# Altium project fast-open-switch r1.0.PrjPcb (part 8 of 8)
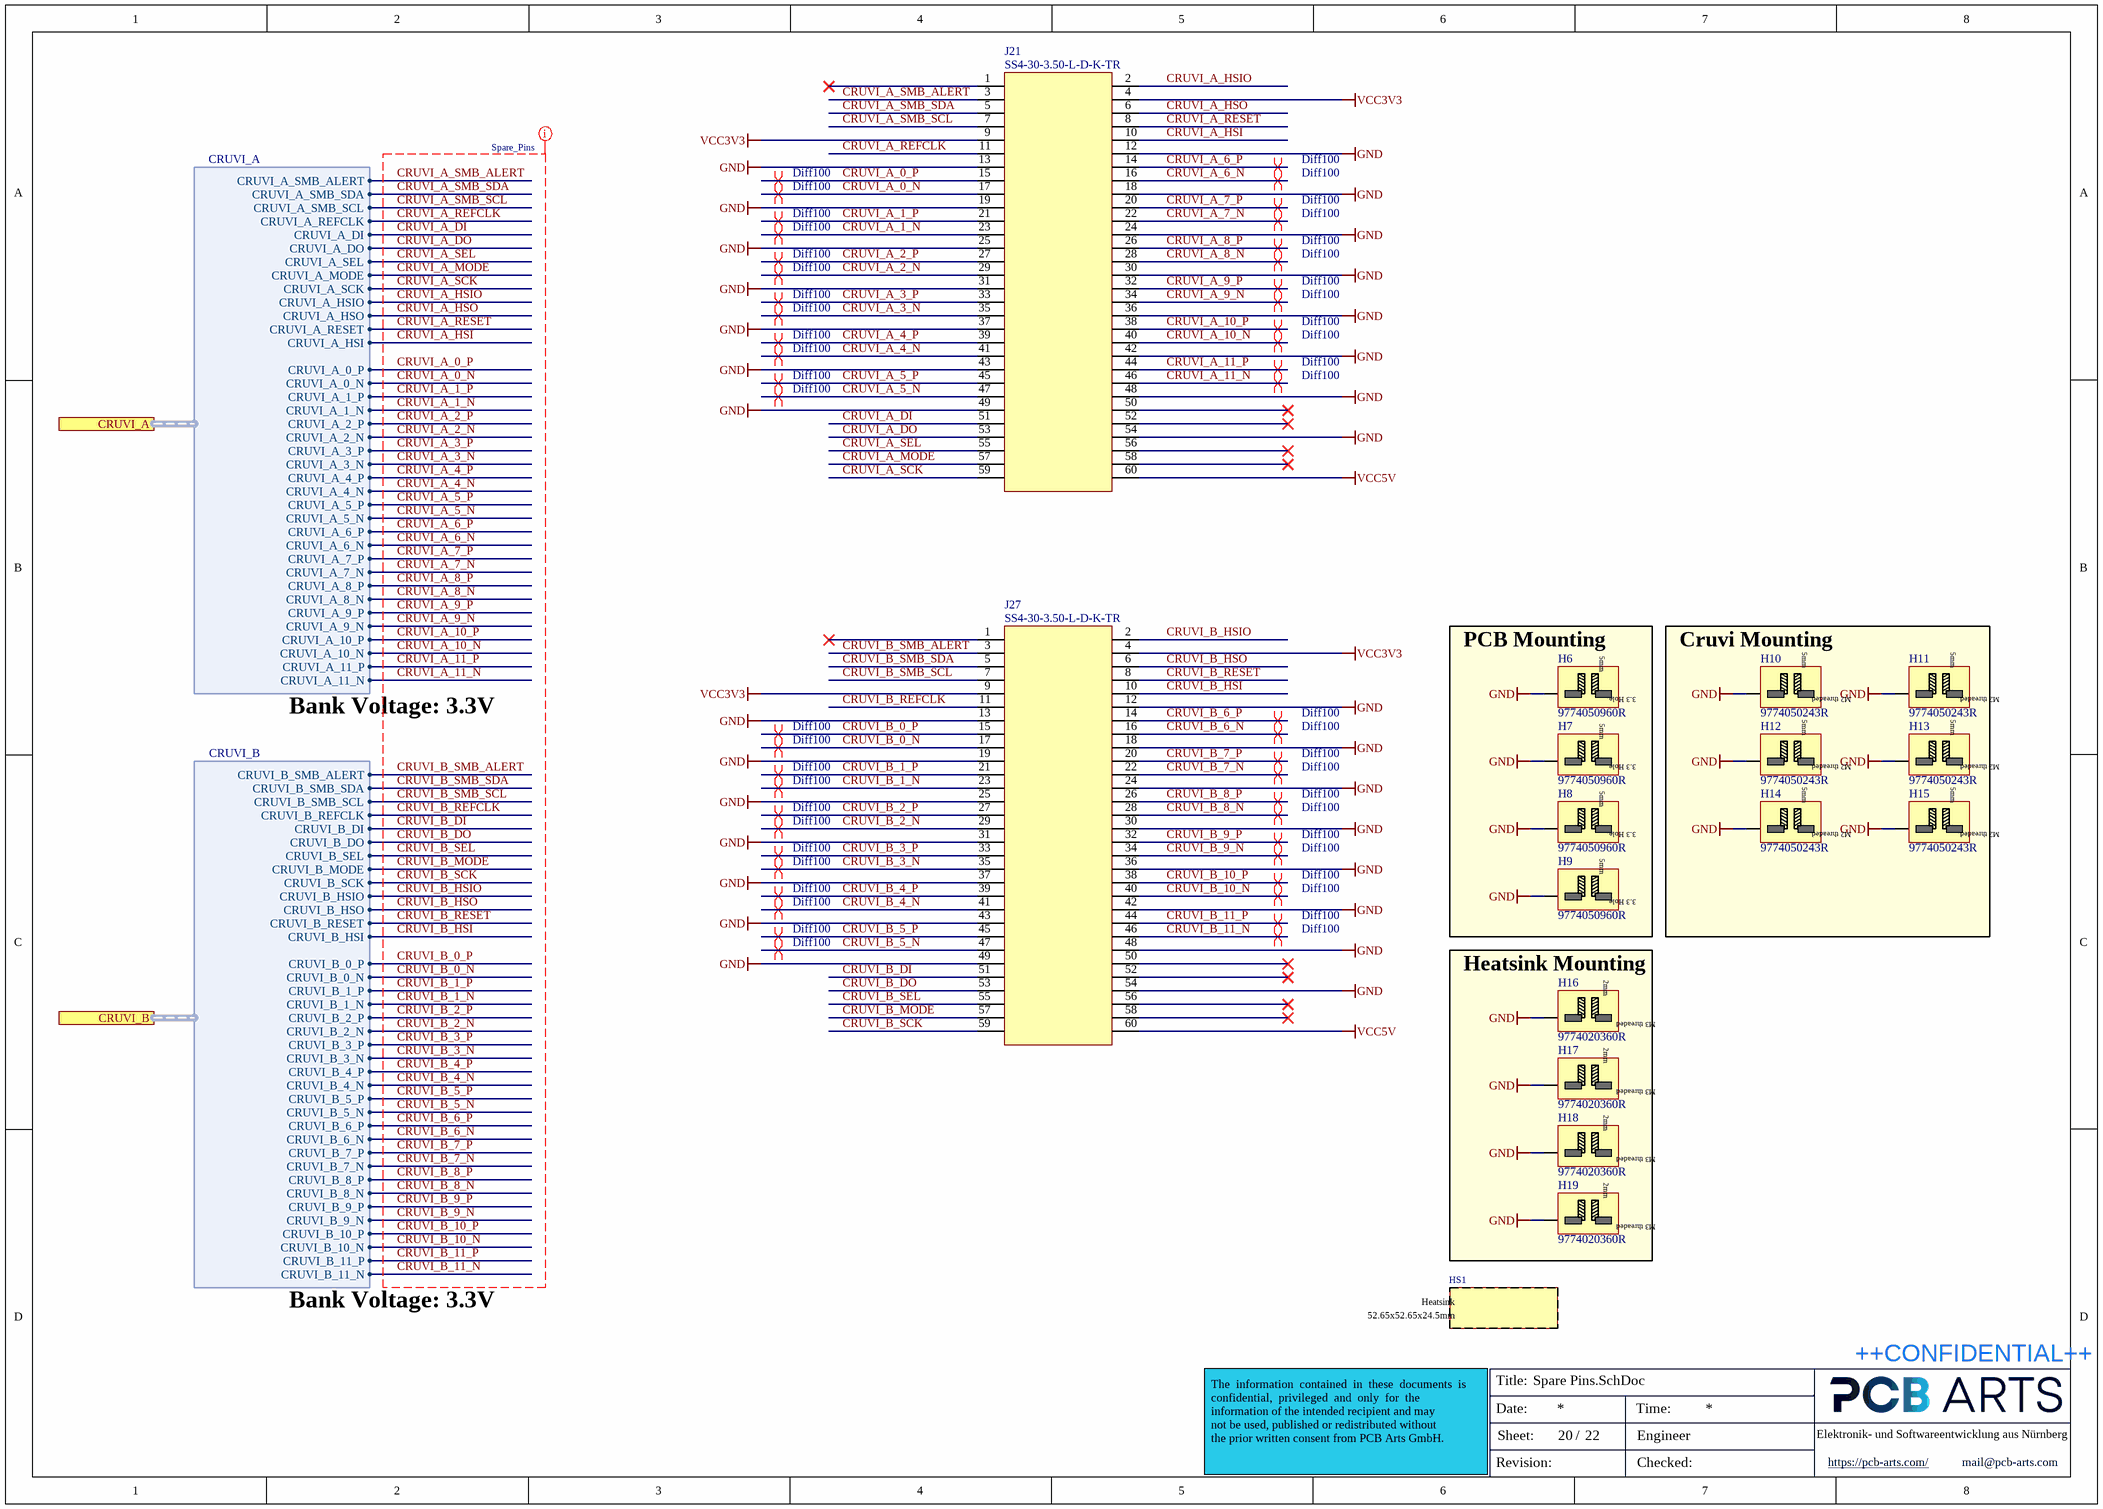
[diagram p22: Spare Pins.SchDoc]

## Nets that join several sheets
CM4_3V3: Raspberry Pi CM4 (9 pins), Raspberry Pi CM4_Periphery (C116.1 J9.10 J9.12 J12.4)
GND: Bank 0_Bank 14 (31 pins), Bank 13_Bank 15_Bank 16 (J16.0 J16.1 J29.1 J30.1), DDR3 Memory_Banks 32-33-34 (21 pins), DDR3 Memory_SO-DIMM (85 pins), FPGA_HDMI_IN_OUT (81 pins), HMI (34 pins), QSPI Flash_eMMC_uSD-Card (38 pins), Raspberry Pi CM4 (60 pins), SFP+_Connectors (68 pins), SSD M.2_B-Key (14 pins), USB-HUB-MUX (75 pins), USB-UART-interface (18 pins), Raspberry Pi CM4_Periphery (45 pins), I2C Multiplexer (5 pins), System Clocks (27 pins), FPGA Supply Pins (187 pins), PWR_CTRL (28 pins), Buck Modules (172 pins), Spare Pins (44 pins)
MGTAVCC: FPGA Supply Pins (11 pins), PWR_CTRL (R226.2), Buck Modules (9 pins)
MGTAVTT: MGT Banks 115-116 (R16.2 U1.M5), FPGA Supply Pins (16 pins), PWR_CTRL (R222.2), Buck Modules (9 pins)
VCC1V0_FPGA: FPGA Supply Pins (36 pins), PWR_CTRL (R215.2), Buck Modules (16 pins)
VCC1V5: DDR3 Memory_Banks 32-33-34 (8 pins), DDR3 Memory_SO-DIMM (43 pins), FPGA Supply Pins (27 pins), Buck Modules (9 pins)
VCC1V8: Bank 0_Bank 14 (5 pins), HMI (15 pins), QSPI Flash_eMMC_uSD-Card (29 pins), SMI Bank 12 (Q5.1 Q6.1 R88.2 R90.2), I2C Multiplexer (8 pins), System Clocks (18 pins), FPGA Supply Pins (19 pins), Buck Modules (9 pins)
VCC1V8_AUX: FPGA Supply Pins (17 pins), PWR_CTRL (R220.2), Buck Modules (9 pins)
VCC2V5: Bank 0_Bank 14 (9 pins), DDR3 Memory_Banks 32-33-34 (U2.7), QSPI Flash_eMMC_uSD-Card (C161.2 U16.8), FPGA Supply Pins (5 pins), Buck Modules (9 pins)
VCC3V3: Bank 0_Bank 14 (C148.1 D29.2 R96.1 U12.5), Bank 13_Bank 15_Bank 16 (10 pins), DDR3 Memory_Banks 32-33-34 (C4.1 C5.2 U2.10), DDR3 Memory_SO-DIMM (C15.2 J1.199 R12.2 R13.2), FPGA_HDMI_IN_OUT (25 pins), HMI (J25.2 J28.4 R173.2 R174.2), QSPI Flash_eMMC_uSD-Card (16 pins), Raspberry Pi CM4 (R69.2), SFP+_Connectors (40 pins), SMI Bank 12 (R87.2 R89.2), SSD M.2_B-Key (9 pins), USB-HUB-MUX (12 pins), System Clocks (C195.2 R208.2 R209.2 U24.8), FPGA Supply Pins (28 pins), Buck Modules (14 pins), Spare Pins (J21.4 J21.9 J27.4 J27.9)
VCC5V: Bank 13_Bank 15_Bank 16 (J16.2 R92.2), FPGA_HDMI_IN_OUT (5 pins), Raspberry Pi CM4 (6 pins), USB-HUB-MUX (C140.1 U8.5), Raspberry Pi CM4_Periphery (5 pins), PWR_CTRL (R213.2), Buck Modules (9 pins), Spare Pins (J21.60 J27.60)
VCC5V_SB: PWR_CTRL (12 pins), Buck Modules (C399.1 C400.1 U40.5 U41.5)
VCC12V: Bank 13_Bank 15_Bank 16 (J29.2 J30.2), PWR_CTRL (8 pins), Buck Modules (70 pins)
VCC_USB: Bank 0_Bank 14 (R98.2), USB-HUB-MUX (6 pins)
VTTDDR: DDR3 Memory_Banks 32-33-34 (6 pins), DDR3 Memory_SO-DIMM (10 pins)
VTTVREF: DDR3 Memory_Banks 32-33-34 (11 pins), DDR3 Memory_SO-DIMM (C16.1 J1.1 J1.126)
150MHz_REFCLK_N: MGT Banks 115-116 (R18.2 U1.F5), System Clocks (Y5.5)
150MHz_REFCLK_P: MGT Banks 115-116 (R18.1 U1.F6), System Clocks (Y5.4)
156.25MHz_REFCLK_N: MGT Banks 115-116 (R19.2 U1.H5), System Clocks (Y6.5)
156.25MHz_REFCLK_P: MGT Banks 115-116 (R19.1 U1.H6), System Clocks (Y6.4)
200MHz_SYSCLK_N: DDR3 Memory_Banks 32-33-34 (R9.1 U1.AD9), System Clocks (Y4.5)
200MHz_SYSCLK_P: DDR3 Memory_Banks 32-33-34 (R9.2 U1.AC9), System Clocks (Y4.4)
Button_C: Bank 0_Bank 14 (U1.H23), HMI (C418.1 J28.5 R180.1 R258.1)
Button_D: Bank 0_Bank 14 (U1.G22), HMI (C420.1 J28.3 R260.1 R261.1)
Button_L: Bank 0_Bank 14 (U1.H22), HMI (C417.1 J28.1 R179.1 R257.1)
Button_R: Bank 0_Bank 14 (U1.H24), HMI (C419.1 J28.7 R185.1 R259.1)
Button_U: Bank 0_Bank 14 (U1.J24), HMI (C416.1 J28.9 R175.1 R178.1)
CM4_GBE_LED_G: Raspberry Pi CM4 (J7.17), Raspberry Pi CM4_Periphery (R77.1)
CM4_GBE_LED_Y: Raspberry Pi CM4 (J7.15), Raspberry Pi CM4_Periphery (R76.1)
CM4_GBE_MDI0_N: Raspberry Pi CM4 (J7.10), Raspberry Pi CM4_Periphery (T1.14)
CM4_GBE_MDI0_P: Raspberry Pi CM4 (J7.12), Raspberry Pi CM4_Periphery (T1.13)
CM4_GBE_MDI1_N: Raspberry Pi CM4 (J7.6), Raspberry Pi CM4_Periphery (T1.17)
CM4_GBE_MDI1_P: Raspberry Pi CM4 (J7.4), Raspberry Pi CM4_Periphery (T1.16)
CM4_GBE_MDI2_N: Raspberry Pi CM4 (J7.9), Raspberry Pi CM4_Periphery (T1.20)
CM4_GBE_MDI2_P: Raspberry Pi CM4 (J7.11), Raspberry Pi CM4_Periphery (T1.19)
CM4_GBE_MDI3_N: Raspberry Pi CM4 (J7.5), Raspberry Pi CM4_Periphery (T1.22)
CM4_GBE_MDI3_P: Raspberry Pi CM4 (J7.3), Raspberry Pi CM4_Periphery (T1.23)
CM4_OTG_ID: Raspberry Pi CM4 (J8.101), USB-HUB-MUX (R68.2 R132.2 U10.2)
CM4_USB_N: Raspberry Pi CM4 (J8.103), USB-HUB-MUX (U10.4)
CM4_USB_P: Raspberry Pi CM4 (J8.105), USB-HUB-MUX (U10.3)
CM4_µSD_CLK: Raspberry Pi CM4 (J7.57), Raspberry Pi CM4_Periphery (D20.2 J12.5)
CM4_µSD_CMD: Raspberry Pi CM4 (J7.62), Raspberry Pi CM4_Periphery (D21.2 J12.3)
CM4_µSD_DAT0: Raspberry Pi CM4 (J7.63), Raspberry Pi CM4_Periphery (D16.2 J12.7)
CM4_µSD_DAT1: Raspberry Pi CM4 (J7.67), Raspberry Pi CM4_Periphery (D17.2 J12.8)
CM4_µSD_DAT2: Raspberry Pi CM4 (J7.69), Raspberry Pi CM4_Periphery (D18.2 J12.1)
CM4_µSD_DAT3: Raspberry Pi CM4 (J7.61), Raspberry Pi CM4_Periphery (D19.2 J12.2)
CRUVI_A_0_N: Bank 13_Bank 15_Bank 16 (U1.F13), Spare Pins (J21.17)
CRUVI_A_0_P: Bank 13_Bank 15_Bank 16 (U1.F14), Spare Pins (J21.15)
CRUVI_A_1_N: Bank 13_Bank 15_Bank 16 (U1.A12), Spare Pins (J21.23)
CRUVI_A_1_P: Bank 13_Bank 15_Bank 16 (U1.A13), Spare Pins (J21.21)
CRUVI_A_2_N: Bank 13_Bank 15_Bank 16 (U1.D8), Spare Pins (J21.29)
CRUVI_A_2_P: Bank 13_Bank 15_Bank 16 (U1.D9), Spare Pins (J21.27)
CRUVI_A_3_N: Bank 13_Bank 15_Bank 16 (U1.B9), Spare Pins (J21.35)
CRUVI_A_3_P: Bank 13_Bank 15_Bank 16 (U1.C9), Spare Pins (J21.33)
CRUVI_A_4_N: Bank 13_Bank 15_Bank 16 (U1.A10), Spare Pins (J21.41)
CRUVI_A_4_P: Bank 13_Bank 15_Bank 16 (U1.B10), Spare Pins (J21.39)
CRUVI_A_5_N: Bank 13_Bank 15_Bank 16 (U1.B11), Spare Pins (J21.47)
CRUVI_A_5_P: Bank 13_Bank 15_Bank 16 (U1.B12), Spare Pins (J21.45)
CRUVI_A_6_N: Bank 13_Bank 15_Bank 16 (U1.C11), Spare Pins (J21.16)
CRUVI_A_6_P: Bank 13_Bank 15_Bank 16 (U1.C12), Spare Pins (J21.14)
CRUVI_A_7_N: Bank 13_Bank 15_Bank 16 (U1.A14), Spare Pins (J21.22)
CRUVI_A_7_P: Bank 13_Bank 15_Bank 16 (U1.B14), Spare Pins (J21.20)
CRUVI_A_8_N: Bank 13_Bank 15_Bank 16 (U1.A15), Spare Pins (J21.28)
CRUVI_A_8_P: Bank 13_Bank 15_Bank 16 (U1.B15), Spare Pins (J21.26)
CRUVI_A_9_N: Bank 13_Bank 15_Bank 16 (U1.C13), Spare Pins (J21.34)
CRUVI_A_9_P: Bank 13_Bank 15_Bank 16 (U1.C14), Spare Pins (J21.32)
CRUVI_A_10_N: Bank 13_Bank 15_Bank 16 (U1.G14), Spare Pins (J21.40)
CRUVI_A_10_P: Bank 13_Bank 15_Bank 16 (U1.H14), Spare Pins (J21.38)
CRUVI_A_11_N: Bank 13_Bank 15_Bank 16 (U1.D13), Spare Pins (J21.46)
CRUVI_A_11_P: Bank 13_Bank 15_Bank 16 (U1.D14), Spare Pins (J21.44)
CRUVI_A_DI: Bank 13_Bank 15_Bank 16 (U1.G19), Spare Pins (J21.51)
CRUVI_A_DO: Bank 13_Bank 15_Bank 16 (U1.D20), Spare Pins (J21.53)
CRUVI_A_HSI: Bank 13_Bank 15_Bank 16 (U1.F17), Spare Pins (J21.10)
CRUVI_A_HSIO: Bank 13_Bank 15_Bank 16 (U1.H18), Spare Pins (J21.2)
CRUVI_A_HSO: Bank 13_Bank 15_Bank 16 (U1.H17), Spare Pins (J21.6)
CRUVI_A_MODE: Bank 13_Bank 15_Bank 16 (U1.F20), Spare Pins (J21.57)
CRUVI_A_REFCLK: Bank 13_Bank 15_Bank 16 (U1.E17), Spare Pins (J21.11)
CRUVI_A_RESET: Bank 13_Bank 15_Bank 16 (U1.H16), Spare Pins (J21.8)
CRUVI_A_SCK: Bank 13_Bank 15_Bank 16 (U1.G20), Spare Pins (J21.59)
CRUVI_A_SEL: Bank 13_Bank 15_Bank 16 (U1.E20), Spare Pins (J21.55)
CRUVI_A_SMB_ALERT: Bank 13_Bank 15_Bank 16 (U1.H19), Spare Pins (J21.3)
CRUVI_A_SMB_SCL: Bank 13_Bank 15_Bank 16 (R285.1 U1.G17), Spare Pins (J21.7)
CRUVI_A_SMB_SDA: Bank 13_Bank 15_Bank 16 (R283.1 U1.F19), Spare Pins (J21.5)
CRUVI_B_0_N: Bank 13_Bank 15_Bank 16 (U1.J10), Spare Pins (J27.17)
CRUVI_B_0_P: Bank 13_Bank 15_Bank 16 (U1.J11), Spare Pins (J27.15)
CRUVI_B_1_N: Bank 13_Bank 15_Bank 16 (U1.H8), Spare Pins (J27.23)
CRUVI_B_1_P: Bank 13_Bank 15_Bank 16 (U1.H9), Spare Pins (J27.21)
CRUVI_B_2_N: Bank 13_Bank 15_Bank 16 (U1.G9), Spare Pins (J27.29)
CRUVI_B_2_P: Bank 13_Bank 15_Bank 16 (U1.G10), Spare Pins (J27.27)
CRUVI_B_3_N: Bank 13_Bank 15_Bank 16 (U1.F8), Spare Pins (J27.35)
CRUVI_B_3_P: Bank 13_Bank 15_Bank 16 (U1.F9), Spare Pins (J27.33)
CRUVI_B_4_N: Bank 13_Bank 15_Bank 16 (U1.F10), Spare Pins (J27.41)
CRUVI_B_4_P: Bank 13_Bank 15_Bank 16 (U1.G11), Spare Pins (J27.39)
CRUVI_B_5_N: Bank 13_Bank 15_Bank 16 (U1.D10), Spare Pins (J27.47)
CRUVI_B_5_P: Bank 13_Bank 15_Bank 16 (U1.E10), Spare Pins (J27.45)
CRUVI_B_6_N: Bank 13_Bank 15_Bank 16 (U1.A8), Spare Pins (J27.16)
CRUVI_B_6_P: Bank 13_Bank 15_Bank 16 (U1.A9), Spare Pins (J27.14)
CRUVI_B_7_N: Bank 13_Bank 15_Bank 16 (U1.D11), Spare Pins (J27.22)
CRUVI_B_7_P: Bank 13_Bank 15_Bank 16 (U1.E11), Spare Pins (J27.20)
CRUVI_B_8_N: Bank 13_Bank 15_Bank 16 (U1.F12), Spare Pins (J27.28)
CRUVI_B_8_P: Bank 13_Bank 15_Bank 16 (U1.G12), Spare Pins (J27.26)
CRUVI_B_9_N: Bank 13_Bank 15_Bank 16 (U1.E12), Spare Pins (J27.34)
CRUVI_B_9_P: Bank 13_Bank 15_Bank 16 (U1.E13), Spare Pins (J27.32)
CRUVI_B_10_N: Bank 13_Bank 15_Bank 16 (U1.H11), Spare Pins (J27.40)
CRUVI_B_10_P: Bank 13_Bank 15_Bank 16 (U1.H12), Spare Pins (J27.38)
CRUVI_B_11_N: Bank 13_Bank 15_Bank 16 (U1.H13), Spare Pins (J27.46)
CRUVI_B_11_P: Bank 13_Bank 15_Bank 16 (U1.J13), Spare Pins (J27.44)
CRUVI_B_DI: Bank 13_Bank 15_Bank 16 (U1.J15), Spare Pins (J27.51)
CRUVI_B_DO: Bank 13_Bank 15_Bank 16 (U1.C18), Spare Pins (J27.53)
CRUVI_B_HSI: Bank 13_Bank 15_Bank 16 (U1.G16), Spare Pins (J27.10)
CRUVI_B_HSIO: Bank 13_Bank 15_Bank 16 (U1.F15), Spare Pins (J27.2)
CRUVI_B_HSO: Bank 13_Bank 15_Bank 16 (U1.D16), Spare Pins (J27.6)
CRUVI_B_MODE: Bank 13_Bank 15_Bank 16 (U1.E18), Spare Pins (J27.57)
CRUVI_B_REFCLK: Bank 13_Bank 15_Bank 16 (U1.E16), Spare Pins (J27.11)
CRUVI_B_RESET: Bank 13_Bank 15_Bank 16 (U1.D15), Spare Pins (J27.8)
CRUVI_B_SCK: Bank 13_Bank 15_Bank 16 (U1.D19), Spare Pins (J27.59)
CRUVI_B_SEL: Bank 13_Bank 15_Bank 16 (U1.D18), Spare Pins (J27.55)
CRUVI_B_SMB_ALERT: Bank 13_Bank 15_Bank 16 (U1.G15), Spare Pins (J27.3)
CRUVI_B_SMB_SCL: Bank 13_Bank 15_Bank 16 (R286.1 U1.E15), Spare Pins (J27.7)
CRUVI_B_SMB_SDA: Bank 13_Bank 15_Bank 16 (R284.1 U1.J16), Spare Pins (J27.5)
CS_MAN_CTRL: Bank 0_Bank 14 (U1.C22), QSPI Flash_eMMC_uSD-Card (J20.16 R117.1)
DDR3_A0: DDR3 Memory_Banks 32-33-34 (U1.AF7), DDR3 Memory_SO-DIMM (J1.98)
DDR3_A1: DDR3 Memory_Banks 32-33-34 (U1.AD8), DDR3 Memory_SO-DIMM (J1.97)
DDR3_A2: DDR3 Memory_Banks 32-33-34 (U1.AB10), DDR3 Memory_SO-DIMM (J1.96)
DDR3_A3: DDR3 Memory_Banks 32-33-34 (U1.AC8), DDR3 Memory_SO-DIMM (J1.95)
DDR3_A4: DDR3 Memory_Banks 32-33-34 (U1.W11), DDR3 Memory_SO-DIMM (J1.92)
DDR3_A5: DDR3 Memory_Banks 32-33-34 (U1.AA12), DDR3 Memory_SO-DIMM (J1.91)
DDR3_A6: DDR3 Memory_Banks 32-33-34 (U1.AC12), DDR3 Memory_SO-DIMM (J1.90)
DDR3_A7: DDR3 Memory_Banks 32-33-34 (U1.AD13), DDR3 Memory_SO-DIMM (J1.86)
DDR3_A8: DDR3 Memory_Banks 32-33-34 (U1.AB12), DDR3 Memory_SO-DIMM (J1.89)
DDR3_A9: DDR3 Memory_Banks 32-33-34 (U1.AD11), DDR3 Memory_SO-DIMM (J1.85)
DDR3_A10: DDR3 Memory_Banks 32-33-34 (U1.AE7), DDR3 Memory_SO-DIMM (J1.107)
DDR3_A11: DDR3 Memory_Banks 32-33-34 (U1.Y11), DDR3 Memory_SO-DIMM (J1.84)
DDR3_A12: DDR3 Memory_Banks 32-33-34 (U1.AA13), DDR3 Memory_SO-DIMM (J1.83)
DDR3_A13: DDR3 Memory_Banks 32-33-34 (U1.AB7), DDR3 Memory_SO-DIMM (J1.119)
DDR3_A14: DDR3 Memory_Banks 32-33-34 (U1.Y13), DDR3 Memory_SO-DIMM (J1.80)
DDR3_A15: DDR3 Memory_Banks 32-33-34 (U1.Y12), DDR3 Memory_SO-DIMM (J1.78)
DDR3_BA0: DDR3 Memory_Banks 32-33-34 (U1.AC7), DDR3 Memory_SO-DIMM (J1.109)
DDR3_BA1: DDR3 Memory_Banks 32-33-34 (U1.V8), DDR3 Memory_SO-DIMM (J1.108)
DDR3_BA2: DDR3 Memory_Banks 32-33-34 (U1.AC13), DDR3 Memory_SO-DIMM (J1.79)
DDR3_~{CAS}: DDR3 Memory_Banks 32-33-34 (U1.AA7), DDR3 Memory_SO-DIMM (J1.115)
DDR3_CKE0: DDR3 Memory_Banks 32-33-34 (U1.Y10), DDR3 Memory_SO-DIMM (J1.73 R10.2)
DDR3_CKE1: DDR3 Memory_Banks 32-33-34 (U1.W9), DDR3 Memory_SO-DIMM (J1.74 R11.2)
DDR3_CLK0_N: DDR3 Memory_Banks 32-33-34 (U1.AC11), DDR3 Memory_SO-DIMM (J1.103)
DDR3_CLK0_P: DDR3 Memory_Banks 32-33-34 (U1.AB11), DDR3 Memory_SO-DIMM (J1.101)
DDR3_CLK1_N: DDR3 Memory_Banks 32-33-34 (U1.AB9), DDR3 Memory_SO-DIMM (J1.104)
DDR3_CLK1_P: DDR3 Memory_Banks 32-33-34 (U1.AA9), DDR3 Memory_SO-DIMM (J1.102)
DDR3_D0: DDR3 Memory_Banks 32-33-34 (U1.AB17), DDR3 Memory_SO-DIMM (J1.5)
DDR3_D1: DDR3 Memory_Banks 32-33-34 (U1.AC18), DDR3 Memory_SO-DIMM (J1.7)
DDR3_D2: DDR3 Memory_Banks 32-33-34 (U1.AC17), DDR3 Memory_SO-DIMM (J1.15)
DDR3_D3: DDR3 Memory_Banks 32-33-34 (U1.AD19), DDR3 Memory_SO-DIMM (J1.17)
DDR3_D4: DDR3 Memory_Banks 32-33-34 (U1.AA19), DDR3 Memory_SO-DIMM (J1.4)
DDR3_D5: DDR3 Memory_Banks 32-33-34 (U1.AA20), DDR3 Memory_SO-DIMM (J1.6)
DDR3_D6: DDR3 Memory_Banks 32-33-34 (U1.AD18), DDR3 Memory_SO-DIMM (J1.16)
DDR3_D7: DDR3 Memory_Banks 32-33-34 (U1.AC16), DDR3 Memory_SO-DIMM (J1.18)
DDR3_D8: DDR3 Memory_Banks 32-33-34 (U1.V16), DDR3 Memory_SO-DIMM (J1.21)
DDR3_D9: DDR3 Memory_Banks 32-33-34 (U1.V18), DDR3 Memory_SO-DIMM (J1.23)
DDR3_D10: DDR3 Memory_Banks 32-33-34 (U1.AB20), DDR3 Memory_SO-DIMM (J1.33)
DDR3_D11: DDR3 Memory_Banks 32-33-34 (U1.AB19), DDR3 Memory_SO-DIMM (J1.35)
DDR3_D12: DDR3 Memory_Banks 32-33-34 (U1.W15), DDR3 Memory_SO-DIMM (J1.22)
DDR3_D13: DDR3 Memory_Banks 32-33-34 (U1.V19), DDR3 Memory_SO-DIMM (J1.24)
DDR3_D14: DDR3 Memory_Banks 32-33-34 (U1.W16), DDR3 Memory_SO-DIMM (J1.34)
DDR3_D15: DDR3 Memory_Banks 32-33-34 (U1.Y17), DDR3 Memory_SO-DIMM (J1.36)
DDR3_D16: DDR3 Memory_Banks 32-33-34 (U1.AF19), DDR3 Memory_SO-DIMM (J1.39)
DDR3_D17: DDR3 Memory_Banks 32-33-34 (U1.AE17), DDR3 Memory_SO-DIMM (J1.41)
DDR3_D18: DDR3 Memory_Banks 32-33-34 (U1.AE15), DDR3 Memory_SO-DIMM (J1.51)
DDR3_D19: DDR3 Memory_Banks 32-33-34 (U1.AF15), DDR3 Memory_SO-DIMM (J1.53)
DDR3_D20: DDR3 Memory_Banks 32-33-34 (U1.AF20), DDR3 Memory_SO-DIMM (J1.40)
DDR3_D21: DDR3 Memory_Banks 32-33-34 (U1.AD16), DDR3 Memory_SO-DIMM (J1.42)
DDR3_D22: DDR3 Memory_Banks 32-33-34 (U1.AD15), DDR3 Memory_SO-DIMM (J1.50)
DDR3_D23: DDR3 Memory_Banks 32-33-34 (U1.AF14), DDR3 Memory_SO-DIMM (J1.52)
DDR3_D24: DDR3 Memory_Banks 32-33-34 (U1.AA15), DDR3 Memory_SO-DIMM (J1.57)
DDR3_D25: DDR3 Memory_Banks 32-33-34 (U1.AB16), DDR3 Memory_SO-DIMM (J1.59)
DDR3_D26: DDR3 Memory_Banks 32-33-34 (U1.AD14), DDR3 Memory_SO-DIMM (J1.67)
DDR3_D27: DDR3 Memory_Banks 32-33-34 (U1.AB14), DDR3 Memory_SO-DIMM (J1.69)
DDR3_D28: DDR3 Memory_Banks 32-33-34 (U1.AA18), DDR3 Memory_SO-DIMM (J1.56)
DDR3_D29: DDR3 Memory_Banks 32-33-34 (U1.AA17), DDR3 Memory_SO-DIMM (J1.58)
DDR3_D30: DDR3 Memory_Banks 32-33-34 (U1.AB15), DDR3 Memory_SO-DIMM (J1.68)
DDR3_D31: DDR3 Memory_Banks 32-33-34 (U1.AC14), DDR3 Memory_SO-DIMM (J1.70)
DDR3_D32: DDR3 Memory_Banks 32-33-34 (U1.AD6), DDR3 Memory_SO-DIMM (J1.129)
DDR3_D33: DDR3 Memory_Banks 32-33-34 (U1.AC6), DDR3 Memory_SO-DIMM (J1.131)
DDR3_D34: DDR3 Memory_Banks 32-33-34 (U1.AC3), DDR3 Memory_SO-DIMM (J1.141)
DDR3_D35: DDR3 Memory_Banks 32-33-34 (U1.AB4), DDR3 Memory_SO-DIMM (J1.143)
DDR3_D36: DDR3 Memory_Banks 32-33-34 (U1.AB6), DDR3 Memory_SO-DIMM (J1.130)
DDR3_D37: DDR3 Memory_Banks 32-33-34 (U1.Y6), DDR3 Memory_SO-DIMM (J1.132)
DDR3_D38: DDR3 Memory_Banks 32-33-34 (U1.Y5), DDR3 Memory_SO-DIMM (J1.140)
DDR3_D39: DDR3 Memory_Banks 32-33-34 (U1.AA4), DDR3 Memory_SO-DIMM (J1.142)
DDR3_D40: DDR3 Memory_Banks 32-33-34 (U1.AF3), DDR3 Memory_SO-DIMM (J1.147)
DDR3_D41: DDR3 Memory_Banks 32-33-34 (U1.AE3), DDR3 Memory_SO-DIMM (J1.149)
DDR3_D42: DDR3 Memory_Banks 32-33-34 (U1.AE2), DDR3 Memory_SO-DIMM (J1.157)
DDR3_D43: DDR3 Memory_Banks 32-33-34 (U1.AE1), DDR3 Memory_SO-DIMM (J1.159)
DDR3_D44: DDR3 Memory_Banks 32-33-34 (U1.AE6), DDR3 Memory_SO-DIMM (J1.146)
DDR3_D45: DDR3 Memory_Banks 32-33-34 (U1.AE5), DDR3 Memory_SO-DIMM (J1.148)
DDR3_D46: DDR3 Memory_Banks 32-33-34 (U1.AD4), DDR3 Memory_SO-DIMM (J1.158)
DDR3_D47: DDR3 Memory_Banks 32-33-34 (U1.AD1), DDR3 Memory_SO-DIMM (J1.160)
DDR3_D48: DDR3 Memory_Banks 32-33-34 (U1.W3), DDR3 Memory_SO-DIMM (J1.163)
DDR3_D49: DDR3 Memory_Banks 32-33-34 (U1.V4), DDR3 Memory_SO-DIMM (J1.165)
DDR3_D50: DDR3 Memory_Banks 32-33-34 (U1.U2), DDR3 Memory_SO-DIMM (J1.175)
DDR3_D51: DDR3 Memory_Banks 32-33-34 (U1.U5), DDR3 Memory_SO-DIMM (J1.177)
DDR3_D52: DDR3 Memory_Banks 32-33-34 (U1.V6), DDR3 Memory_SO-DIMM (J1.164)
DDR3_D53: DDR3 Memory_Banks 32-33-34 (U1.V3), DDR3 Memory_SO-DIMM (J1.166)
DDR3_D54: DDR3 Memory_Banks 32-33-34 (U1.U1), DDR3 Memory_SO-DIMM (J1.174)
DDR3_D55: DDR3 Memory_Banks 32-33-34 (U1.U6), DDR3 Memory_SO-DIMM (J1.176)
DDR3_D56: DDR3 Memory_Banks 32-33-34 (U1.AB2), DDR3 Memory_SO-DIMM (J1.181)
DDR3_D57: DDR3 Memory_Banks 32-33-34 (U1.AA3), DDR3 Memory_SO-DIMM (J1.183)
DDR3_D58: DDR3 Memory_Banks 32-33-34 (U1.W1), DDR3 Memory_SO-DIMM (J1.191)
DDR3_D59: DDR3 Memory_Banks 32-33-34 (U1.V2), DDR3 Memory_SO-DIMM (J1.193)
DDR3_D60: DDR3 Memory_Banks 32-33-34 (U1.AC2), DDR3 Memory_SO-DIMM (J1.180)
DDR3_D61: DDR3 Memory_Banks 32-33-34 (U1.Y3), DDR3 Memory_SO-DIMM (J1.182)
DDR3_D62: DDR3 Memory_Banks 32-33-34 (U1.Y2), DDR3 Memory_SO-DIMM (J1.192)
DDR3_D63: DDR3 Memory_Banks 32-33-34 (U1.V1), DDR3 Memory_SO-DIMM (J1.194)
DDR3_DM0: DDR3 Memory_Banks 32-33-34 (U1.AC19), DDR3 Memory_SO-DIMM (J1.11)
DDR3_DM1: DDR3 Memory_Banks 32-33-34 (U1.V17), DDR3 Memory_SO-DIMM (J1.28)
DDR3_DM2: DDR3 Memory_Banks 32-33-34 (U1.AF17), DDR3 Memory_SO-DIMM (J1.46)
DDR3_DM3: DDR3 Memory_Banks 32-33-34 (U1.AA14), DDR3 Memory_SO-DIMM (J1.63)
DDR3_DM4: DDR3 Memory_Banks 32-33-34 (U1.AC4), DDR3 Memory_SO-DIMM (J1.136)
DDR3_DM5: DDR3 Memory_Banks 32-33-34 (U1.AF2), DDR3 Memory_SO-DIMM (J1.153)
DDR3_DM6: DDR3 Memory_Banks 32-33-34 (U1.U7), DDR3 Memory_SO-DIMM (J1.170)
DDR3_DM7: DDR3 Memory_Banks 32-33-34 (U1.Y1), DDR3 Memory_SO-DIMM (J1.187)
DDR3_DQS0_N: DDR3 Memory_Banks 32-33-34 (U1.AE20), DDR3 Memory_SO-DIMM (J1.10)
DDR3_DQS0_P: DDR3 Memory_Banks 32-33-34 (U1.AD20), DDR3 Memory_SO-DIMM (J1.12)
DDR3_DQS1_N: DDR3 Memory_Banks 32-33-34 (U1.W19), DDR3 Memory_SO-DIMM (J1.27)
DDR3_DQS1_P: DDR3 Memory_Banks 32-33-34 (U1.W18), DDR3 Memory_SO-DIMM (J1.29)
DDR3_DQS2_N: DDR3 Memory_Banks 32-33-34 (U1.AF18), DDR3 Memory_SO-DIMM (J1.45)
DDR3_DQS2_P: DDR3 Memory_Banks 32-33-34 (U1.AE18), DDR3 Memory_SO-DIMM (J1.47)
DDR3_DQS3_N: DDR3 Memory_Banks 32-33-34 (U1.Y16), DDR3 Memory_SO-DIMM (J1.62)
DDR3_DQS3_P: DDR3 Memory_Banks 32-33-34 (U1.Y15), DDR3 Memory_SO-DIMM (J1.64)
DDR3_DQS4_N: DDR3 Memory_Banks 32-33-34 (U1.AB5), DDR3 Memory_SO-DIMM (J1.135)
DDR3_DQS4_P: DDR3 Memory_Banks 32-33-34 (U1.AA5), DDR3 Memory_SO-DIMM (J1.137)
DDR3_DQS5_N: DDR3 Memory_Banks 32-33-34 (U1.AF4), DDR3 Memory_SO-DIMM (J1.152)
DDR3_DQS5_P: DDR3 Memory_Banks 32-33-34 (U1.AF5), DDR3 Memory_SO-DIMM (J1.154)
DDR3_DQS6_N: DDR3 Memory_Banks 32-33-34 (U1.W5), DDR3 Memory_SO-DIMM (J1.169)
DDR3_DQS6_P: DDR3 Memory_Banks 32-33-34 (U1.W6), DDR3 Memory_SO-DIMM (J1.171)
DDR3_DQS7_N: DDR3 Memory_Banks 32-33-34 (U1.AC1), DDR3 Memory_SO-DIMM (J1.186)
DDR3_DQS7_P: DDR3 Memory_Banks 32-33-34 (U1.AB1), DDR3 Memory_SO-DIMM (J1.188)
DDR3_~{EVENT}: DDR3 Memory_Banks 32-33-34 (U1.W10), DDR3 Memory_SO-DIMM (J1.198 R14.1)
DDR3_ODT0: DDR3 Memory_Banks 32-33-34 (U1.AA8), DDR3 Memory_SO-DIMM (J1.116)
DDR3_ODT1: DDR3 Memory_Banks 32-33-34 (U1.V9), DDR3 Memory_SO-DIMM (J1.120)
DDR3_~{RAS}: DDR3 Memory_Banks 32-33-34 (U1.AA10), DDR3 Memory_SO-DIMM (J1.110)
DDR3_~{RESET}: DDR3 Memory_Banks 32-33-34 (U1.V11), DDR3 Memory_SO-DIMM (J1.30 R15.1)
DDR3_~{S0}: DDR3 Memory_Banks 32-33-34 (U1.Y8), DDR3 Memory_SO-DIMM (J1.114)
DDR3_~{S1}: DDR3 Memory_Banks 32-33-34 (U1.V7), DDR3 Memory_SO-DIMM (J1.121)
DDR3_SCL: DDR3 Memory_SO-DIMM (J1.202 R13.1), I2C Multiplexer (U22.4)
DDR3_SDA: DDR3 Memory_SO-DIMM (J1.200 R12.1), I2C Multiplexer (U22.3)
DDR3_~{WE}: DDR3 Memory_Banks 32-33-34 (U1.Y7), DDR3 Memory_SO-DIMM (J1.113)
EN_1V0_FPGA: PWR_CTRL (NT8.1), Buck Modules (U38.4 U39.4)
EN_1V0_MGTAVCC: PWR_CTRL (NT7.1), Buck Modules (U33.4)
EN_1V2_MGTAVTT: PWR_CTRL (NT6.1), Buck Modules (U32.4)
EN_1V5: PWR_CTRL (NT5.1), Buck Modules (U31.4)
EN_1V8: PWR_CTRL (NT3.1), Buck Modules (U29.4)
EN_1V8_AUX: PWR_CTRL (NT4.1), Buck Modules (U30.4)
EN_2V5: PWR_CTRL (NT2.1), Buck Modules (U34.4)
EN_3V3: PWR_CTRL (NT1.1), Buck Modules (U35.4)
EN_5V0: PWR_CTRL (R228.1 R229.2), Buck Modules (U28.4)
FPGA_CLK: Bank 0_Bank 14 (U1.C8), QSPI Flash_eMMC_uSD-Card (U16.6)
FPGA_D0: Bank 0_Bank 14 (U1.B24), QSPI Flash_eMMC_uSD-Card (J20.2 R119.1 R142.1)
FPGA_D1: Bank 0_Bank 14 (U1.A25), QSPI Flash_eMMC_uSD-Card (J20.3 R120.1 R143.1)
FPGA_D2: Bank 0_Bank 14 (U1.B22), QSPI Flash_eMMC_uSD-Card (J20.4 R121.1 R144.1)
FPGA_D3: Bank 0_Bank 14 (U1.A22), QSPI Flash_eMMC_uSD-Card (J20.5 R122.1 R145.1)
FPGA_D4: Bank 0_Bank 14 (U1.A23), QSPI Flash_eMMC_uSD-Card (J20.6 R123.1)
FPGA_D5: Bank 0_Bank 14 (U1.A24), QSPI Flash_eMMC_uSD-Card (J20.7 R124.1)
FPGA_D6: Bank 0_Bank 14 (U1.D26), QSPI Flash_eMMC_uSD-Card (J20.8 R125.1)
FPGA_D7: Bank 0_Bank 14 (U1.C26), QSPI Flash_eMMC_uSD-Card (J20.9 R126.1)
FPGA_~{FCS}: Bank 0_Bank 14 (U1.C23), QSPI Flash_eMMC_uSD-Card (J20.11 U15.3)
FPGA_~{INIT}: Bank 0_Bank 14 (J17.2 R94.2 U1.G7 U12.2), QSPI Flash_eMMC_uSD-Card (U16.7)
FPGA_M0: Bank 0_Bank 14 (R112.2 S3.13 U1.T5), QSPI Flash_eMMC_uSD-Card (J20.15 R118.1)
FPGA_Strobe: Bank 0_Bank 14 (U1.D21), QSPI Flash_eMMC_uSD-Card (J20.14 R130.1)
FPGA_µSD_CD: QSPI Flash_eMMC_uSD-Card (J22.9 R255.1 R256.2), SMI Bank 12 (U1.AC22)
FPGA_µSD_CLK: QSPI Flash_eMMC_uSD-Card (R265.1 U18.6), SMI Bank 12 (U1.AD21)
FPGA_µSD_CMD: QSPI Flash_eMMC_uSD-Card (R264.1 U18.5), SMI Bank 12 (U1.AB22)
FPGA_µSD_DAT0: QSPI Flash_eMMC_uSD-Card (R266.1 U18.7), SMI Bank 12 (U1.AD24)
FPGA_µSD_DAT1: QSPI Flash_eMMC_uSD-Card (R267.1 U18.8), SMI Bank 12 (U1.AC21)
FPGA_µSD_DAT2: QSPI Flash_eMMC_uSD-Card (R262.1 U18.3), SMI Bank 12 (U1.AD23)
FPGA_µSD_DAT3: QSPI Flash_eMMC_uSD-Card (R263.1 U18.4), SMI Bank 12 (U1.AB21)
HDMI_CM4_CEC: Raspberry Pi CM4 (J8.151), Raspberry Pi CM4_Periphery (D12.2 J11.13)
HDMI_CM4_CLOCK_N: Raspberry Pi CM4 (J8.190), Raspberry Pi CM4_Periphery (D11.2 J11.12)
HDMI_CM4_CLOCK_P: Raspberry Pi CM4 (J8.188), Raspberry Pi CM4_Periphery (D10.2 J11.10)
HDMI_CM4_DATA0_N: Raspberry Pi CM4 (J8.184), Raspberry Pi CM4_Periphery (D9.2 J11.9)
HDMI_CM4_DATA0_P: Raspberry Pi CM4 (J8.182), Raspberry Pi CM4_Periphery (D8.2 J11.7)
HDMI_CM4_DATA1_N: Raspberry Pi CM4 (J8.178), Raspberry Pi CM4_Periphery (D7.2 J11.6)
HDMI_CM4_DATA1_P: Raspberry Pi CM4 (J8.176), Raspberry Pi CM4_Periphery (D6.2 J11.4)
HDMI_CM4_DATA2_N: Raspberry Pi CM4 (J8.172), Raspberry Pi CM4_Periphery (D5.2 J11.3)
HDMI_CM4_DATA2_P: Raspberry Pi CM4 (J8.170), Raspberry Pi CM4_Periphery (D4.2 J11.1)
HDMI_CM4_HPD: Raspberry Pi CM4 (J8.153), Raspberry Pi CM4_Periphery (D15.2 J11.19)
HDMI_CM4_SCL: Raspberry Pi CM4 (J8.200), Raspberry Pi CM4_Periphery (D13.2 J11.15)
HDMI_CM4_SDA: Raspberry Pi CM4 (J8.199), Raspberry Pi CM4_Periphery (D14.2 J11.16)
HDMI_FPGA_RX0_N: Bank 13_Bank 15_Bank 16 (U1.N24), FPGA_HDMI_IN_OUT (U21.14)
HDMI_FPGA_RX0_P: Bank 13_Bank 15_Bank 16 (U1.P24), FPGA_HDMI_IN_OUT (U21.15)
HDMI_FPGA_RX1_N: Bank 13_Bank 15_Bank 16 (U1.P26), FPGA_HDMI_IN_OUT (U21.17)
HDMI_FPGA_RX1_P: Bank 13_Bank 15_Bank 16 (U1.R26), FPGA_HDMI_IN_OUT (U21.18)
HDMI_FPGA_RX2_N: Bank 13_Bank 15_Bank 16 (U1.P25), FPGA_HDMI_IN_OUT (U21.19)
HDMI_FPGA_RX2_P: Bank 13_Bank 15_Bank 16 (U1.R25), FPGA_HDMI_IN_OUT (U21.20)
HDMI_FPGA_RXC_N: Bank 13_Bank 15_Bank 16 (U1.L24), FPGA_HDMI_IN_OUT (U21.11)
HDMI_FPGA_RXC_P: Bank 13_Bank 15_Bank 16 (U1.M24), FPGA_HDMI_IN_OUT (U21.12)
HDMI_FPGA_RXCEC: Bank 13_Bank 15_Bank 16 (U1.N23), FPGA_HDMI_IN_OUT (U21.31)
HDMI_FPGA_RXHPD: Bank 13_Bank 15_Bank 16 (U1.M22), FPGA_HDMI_IN_OUT (Q10.1 R170.2)
HDMI_FPGA_RXSCL: Bank 13_Bank 15_Bank 16 (U1.P23), FPGA_HDMI_IN_OUT (R168.1 U21.35)
HDMI_FPGA_RXSDA: Bank 13_Bank 15_Bank 16 (U1.M21), FPGA_HDMI_IN_OUT (R169.1 U21.34)
HDMI_FPGA_TX0_N: Bank 13_Bank 15_Bank 16 (U1.P20), FPGA_HDMI_IN_OUT (U19.35)
HDMI_FPGA_TX0_P: Bank 13_Bank 15_Bank 16 (U1.P19), FPGA_HDMI_IN_OUT (U19.36)
HDMI_FPGA_TX1_N: Bank 13_Bank 15_Bank 16 (U1.K26), FPGA_HDMI_IN_OUT (U19.38)
HDMI_FPGA_TX1_P: Bank 13_Bank 15_Bank 16 (U1.K25), FPGA_HDMI_IN_OUT (U19.39)
HDMI_FPGA_TX2_N: Bank 13_Bank 15_Bank 16 (U1.L25), FPGA_HDMI_IN_OUT (U19.1)
HDMI_FPGA_TX2_P: Bank 13_Bank 15_Bank 16 (U1.M25), FPGA_HDMI_IN_OUT (U19.2)
HDMI_FPGA_TXC_N: Bank 13_Bank 15_Bank 16 (U1.M20), FPGA_HDMI_IN_OUT (U19.32)
HDMI_FPGA_TXC_P: Bank 13_Bank 15_Bank 16 (U1.N19), FPGA_HDMI_IN_OUT (U19.33)
HDMI_FPGA_TXCEC: Bank 13_Bank 15_Bank 16 (U1.N26), FPGA_HDMI_IN_OUT (D44.2 J23.13 R151.2)
HDMI_FPGA_TXHPD: Bank 13_Bank 15_Bank 16 (U1.M26), FPGA_HDMI_IN_OUT (Q9.3 R155.1)
HDMI_FPGA_TXSCL: FPGA_HDMI_IN_OUT (R158.2 U19.29), I2C Multiplexer (U22.2)
HDMI_FPGA_TXSDA: FPGA_HDMI_IN_OUT (R159.2 U19.28), I2C Multiplexer (U22.1)
I2C_OLED_SCL: HMI (J25.3 J28.6 R173.1), I2C Multiplexer (U22.6)
I2C_OLED_SDA: HMI (J25.4 J28.8 R174.1), I2C Multiplexer (U22.5)
JTAG_USB_D_N: Bank 0_Bank 14 (U11.16), USB-HUB-MUX (U9.4)
JTAG_USB_D_P: Bank 0_Bank 14 (U11.17), USB-HUB-MUX (U9.3)
Main_I2C_MUX_RST: SMI Bank 12 (U1.W21), I2C Multiplexer (R199.1 U22.24)
Main_I2C_SCL: SMI Bank 12 (U1.V21), I2C Multiplexer (R198.1 U22.19)
Main_I2C_SDA: SMI Bank 12 (U1.AE22), I2C Multiplexer (R197.1 U22.20)
MGTX115_RX0_N: MGT Banks 115-116 (U1.R3), SFP+_Connectors (J2.13)
MGTX115_RX0_P: MGT Banks 115-116 (U1.R4), SFP+_Connectors (J2.12)
MGTX115_RX1_N: MGT Banks 115-116 (U1.N3), SFP+_Connectors (J3.13)
MGTX115_RX1_P: MGT Banks 115-116 (U1.N4), SFP+_Connectors (J3.12)
MGTX115_RX2_N: MGT Banks 115-116 (U1.L3), SFP+_Connectors (J4.13)
MGTX115_RX2_P: MGT Banks 115-116 (U1.L4), SFP+_Connectors (J4.12)
MGTX115_RX3_N: MGT Banks 115-116 (U1.J3), SFP+_Connectors (J5.13)
MGTX115_RX3_P: MGT Banks 115-116 (U1.J4), SFP+_Connectors (J5.12)
MGTX115_TX0_N: MGT Banks 115-116 (U1.P1), SFP+_Connectors (J2.19)
MGTX115_TX0_P: MGT Banks 115-116 (U1.P2), SFP+_Connectors (J2.18)
MGTX115_TX1_N: MGT Banks 115-116 (U1.M1), SFP+_Connectors (J3.19)
MGTX115_TX1_P: MGT Banks 115-116 (U1.M2), SFP+_Connectors (J3.18)
MGTX115_TX2_N: MGT Banks 115-116 (U1.K1), SFP+_Connectors (J4.19)
MGTX115_TX2_P: MGT Banks 115-116 (U1.K2), SFP+_Connectors (J4.18)
MGTX115_TX3_N: MGT Banks 115-116 (U1.H1), SFP+_Connectors (J5.19)
MGTX115_TX3_P: MGT Banks 115-116 (U1.H2), SFP+_Connectors (J5.18)
PCIe_PERST: Bank 13_Bank 15_Bank 16 (U1.B16), Raspberry Pi CM4 (J8.109)
PCIe_REFCLK_N: MGT Banks 115-116 (U1.D5), Raspberry Pi CM4 (J8.112)
PCIe_REFCLK_P: MGT Banks 115-116 (U1.D6), Raspberry Pi CM4 (J8.110)
PCIe_RX0_N: MGT Banks 115-116 (U1.B5), Raspberry Pi CM4 (J8.124)
PCIe_RX0_P: MGT Banks 115-116 (U1.B6), Raspberry Pi CM4 (J8.122)
PCIe_TX0_N: MGT Banks 115-116 (C82.2), Raspberry Pi CM4 (J8.118)
PCIe_TX0_P: MGT Banks 115-116 (C81.2), Raspberry Pi CM4 (J8.116)
PI_~{EXTRST}: Bank 13_Bank 15_Bank 16 (U1.A18), Raspberry Pi CM4 (J7.100)
REC_CLOCK_C_N: Bank 13_Bank 15_Bank 16 (U1.P21), System Clocks (C191.2 R206.1)
REC_CLOCK_C_P: Bank 13_Bank 15_Bank 16 (U1.R21), System Clocks (C189.2 R206.2)
SATA_RX_N: MGT Banks 115-116 (C86.2), SSD M.2_B-Key (J6.43)
SATA_RX_P: MGT Banks 115-116 (C85.2), SSD M.2_B-Key (J6.41)
SATA_TX_N: MGT Banks 115-116 (C84.2), SSD M.2_B-Key (J6.47)
SATA_TX_P: MGT Banks 115-116 (C83.2), SSD M.2_B-Key (J6.49)
SFP+_0_ACT: Bank 13_Bank 15_Bank 16 (U1.T25), SFP+_Connectors (R276.1)
SFP+_0_I2C_SCL: SFP+_Connectors (J2.5 R23.1), I2C Multiplexer (U22.8)
SFP+_0_I2C_SDA: SFP+_Connectors (J2.4 R22.1), I2C Multiplexer (U22.7)
SFP+_0_Link: Bank 13_Bank 15_Bank 16 (U1.T24), SFP+_Connectors (R275.1)
SFP+_0_LOS: Bank 13_Bank 15_Bank 16 (U1.T19), SFP+_Connectors (J2.8 R30.1)
SFP+_0_TX_DIS: Bank 13_Bank 15_Bank 16 (U1.R18), SFP+_Connectors (Q1.1 R28.2)
SFP+_1_ACT: Bank 13_Bank 15_Bank 16 (U1.R23), SFP+_Connectors (R278.1)
SFP+_1_I2C_SCL: SFP+_Connectors (J3.5 R34.1), I2C Multiplexer (U22.11)
SFP+_1_I2C_SDA: SFP+_Connectors (J3.4 R33.1), I2C Multiplexer (U22.10)
SFP+_1_Link: Bank 13_Bank 15_Bank 16 (U1.T22), SFP+_Connectors (R277.1)
SFP+_1_LOS: Bank 13_Bank 15_Bank 16 (U1.M19), SFP+_Connectors (J3.8 R41.1)
SFP+_1_TX_DIS: Bank 13_Bank 15_Bank 16 (U1.N18), SFP+_Connectors (Q2.1 R39.2)
SFP+_2_ACT: Bank 13_Bank 15_Bank 16 (U1.N21), SFP+_Connectors (R280.1)
SFP+_2_I2C_SCL: SFP+_Connectors (J4.5 R45.1), I2C Multiplexer (U22.13)
SFP+_2_I2C_SDA: SFP+_Connectors (J4.4 R44.1), I2C Multiplexer (U22.12)
SFP+_2_Link: Bank 13_Bank 15_Bank 16 (U1.N22), SFP+_Connectors (R279.1)
SFP+_2_LOS: Bank 13_Bank 15_Bank 16 (U1.R17), SFP+_Connectors (J4.8 R52.1)
SFP+_2_TX_DIS: Bank 13_Bank 15_Bank 16 (U1.N17), SFP+_Connectors (Q3.1 R50.2)
SFP+_3_ACT: Bank 13_Bank 15_Bank 16 (U1.R22), SFP+_Connectors (R282.1)
SFP+_3_I2C_SCL: SFP+_Connectors (J5.5 R56.1), I2C Multiplexer (U22.15)
SFP+_3_I2C_SDA: SFP+_Connectors (J5.4 R55.1), I2C Multiplexer (U22.14)
SFP+_3_Link: Bank 13_Bank 15_Bank 16 (U1.R20), SFP+_Connectors (R281.1)
SFP+_3_LOS: Bank 13_Bank 15_Bank 16 (U1.R16), SFP+_Connectors (J5.8 R63.1)
SFP+_3_TX_DIS: Bank 13_Bank 15_Bank 16 (U1.P16), SFP+_Connectors (Q4.1 R61.2)
SI5324~{_RST}_LS: SMI Bank 12 (U1.V22), System Clocks (U24.2)
SI5324_~{INIT}_LS: SMI Bank 12 (U1.V24), System Clocks (U24.3)
SI5324_REFCLK_N: MGT Banks 115-116 (R17.2 U1.K5), System Clocks (C192.2)
SI5324_REFCLK_P: MGT Banks 115-116 (R17.1 U1.K6), System Clocks (C190.2)
SI5324_SCL: I2C Multiplexer (U22.17), System Clocks (R209.1 U23.22)
SI5324_SDA: I2C Multiplexer (U22.16), System Clocks (R208.1 U23.23)
SMI_SA0: Raspberry Pi CM4 (J7.34), SMI Bank 12 (U1.AB26)
SMI_SA1: Raspberry Pi CM4 (J7.54), SMI Bank 12 (U1.V26)
SMI_SA2: Raspberry Pi CM4 (J7.56), SMI Bank 12 (U1.U24)
SMI_SA3: Raspberry Pi CM4 (J7.58), SMI Bank 12 (U1.U26)
SMI_SA4: Raspberry Pi CM4 (J7.36), SMI Bank 12 (U1.AB25)
SMI_SA5: Raspberry Pi CM4 (J7.35), SMI Bank 12 (U1.V23)
SMI_SD0: Raspberry Pi CM4 (J7.39), SMI Bank 12 (U1.W24)
SMI_SD1: Raspberry Pi CM4 (J7.40), SMI Bank 12 (U1.Y26)
SMI_SD2: Raspberry Pi CM4 (J7.44), SMI Bank 12 (U1.Y25)
SMI_SD3: Raspberry Pi CM4 (J7.38), SMI Bank 12 (U1.AA25)
SMI_SD4: Raspberry Pi CM4 (J7.31), SMI Bank 12 (U1.U22)
SMI_SD5: Raspberry Pi CM4 (J7.28), SMI Bank 12 (U1.AC26)
SMI_SD6: Raspberry Pi CM4 (J7.55), SMI Bank 12 (U1.U25)
SMI_SD7: Raspberry Pi CM4 (J7.51), SMI Bank 12 (U1.AB24)
SMI_SD8: Raspberry Pi CM4 (J7.29), SMI Bank 12 (U1.Y22)
SMI_SD9: Raspberry Pi CM4 (J7.50), SMI Bank 12 (U1.W25)
SMI_SD10: Raspberry Pi CM4 (J7.49), SMI Bank 12 (U1.Y23)
SMI_SD11: Raspberry Pi CM4 (J7.26), SMI Bank 12 (U1.AC23)
SMI_SD12: Raspberry Pi CM4 (J7.27), SMI Bank 12 (U1.Y21)
SMI_SD13: Raspberry Pi CM4 (J7.25), SMI Bank 12 (U1.W20)
SMI_SD14: Raspberry Pi CM4 (J7.46), SMI Bank 12 (U1.W26)
SMI_SD15: Raspberry Pi CM4 (J7.47), SMI Bank 12 (U1.AA23)
SMI_SD16: Raspberry Pi CM4 (J7.45), SMI Bank 12 (U1.AA24)
SMI_SD17: Raspberry Pi CM4 (J7.41), SMI Bank 12 (U1.AA22)
SMI_SOE_N/SE: Raspberry Pi CM4 (J7.30), SMI Bank 12 (U1.AC24)
SMI_SWE_N/SRW_N: Raspberry Pi CM4 (J7.37), SMI Bank 12 (U1.W23)
Switch_0: Bank 0_Bank 14 (U1.E25), HMI (R176.2 S6.13)
Switch_1: Bank 0_Bank 14 (U1.E26), HMI (R177.2 S6.23)
Switch_2: Bank 0_Bank 14 (U1.D25), HMI (R181.2 S6.33)
Switch_3: Bank 0_Bank 14 (U1.F22), HMI (R182.2 S10.13)
Switch_4: Bank 0_Bank 14 (U1.D24), HMI (R183.2 S10.23)
Switch_5: Bank 0_Bank 14 (U1.D23), HMI (R184.2 S10.33)
Switch_6: Bank 0_Bank 14 (U1.E23), HMI (R186.2 S11.13)
Switch_7: Bank 0_Bank 14 (U1.E22), HMI (R187.2 S11.23)
Switch_8: Bank 0_Bank 14 (U1.J25), HMI (R188.2 S11.33)
TEMP_I2C_SCL: SMI Bank 12 (Q6.3 R89.1), Buck Modules (TP20.1 U36.2 U37.2)
TEMP_I2C_SDA: SMI Bank 12 (Q5.3 R87.1), Buck Modules (TP19.1 U36.1 U37.1)
UART_USB_~{CTS}: Bank 13_Bank 15_Bank 16 (U1.F18), USB-UART-interface (R290.2)
UART_USB_~{RTS}: Bank 13_Bank 15_Bank 16 (U1.B17), USB-UART-interface (R289.2)
UART_USB_RxD: Bank 13_Bank 15_Bank 16 (U1.A17), USB-UART-interface (R288.2)
UART_USB_TxD: Bank 13_Bank 15_Bank 16 (U1.K15), USB-UART-interface (R287.2)
USER_LED_0: Bank 0_Bank 14 (U1.F23), HMI (R189.2)
USER_LED_1: Bank 0_Bank 14 (U1.J26), HMI (R190.2)
USER_LED_2: Bank 0_Bank 14 (U1.G26), HMI (R191.2)
USER_LED_3: Bank 0_Bank 14 (U1.H26), HMI (R192.2)
USER_LED_4: Bank 0_Bank 14 (U1.G25), HMI (R193.2)
USER_LED_5: Bank 0_Bank 14 (U1.F24), HMI (R194.2)
USER_LED_6: Bank 0_Bank 14 (U1.F25), HMI (R195.2)
USER_LED_7: Bank 0_Bank 14 (U1.G24), HMI (R196.2)